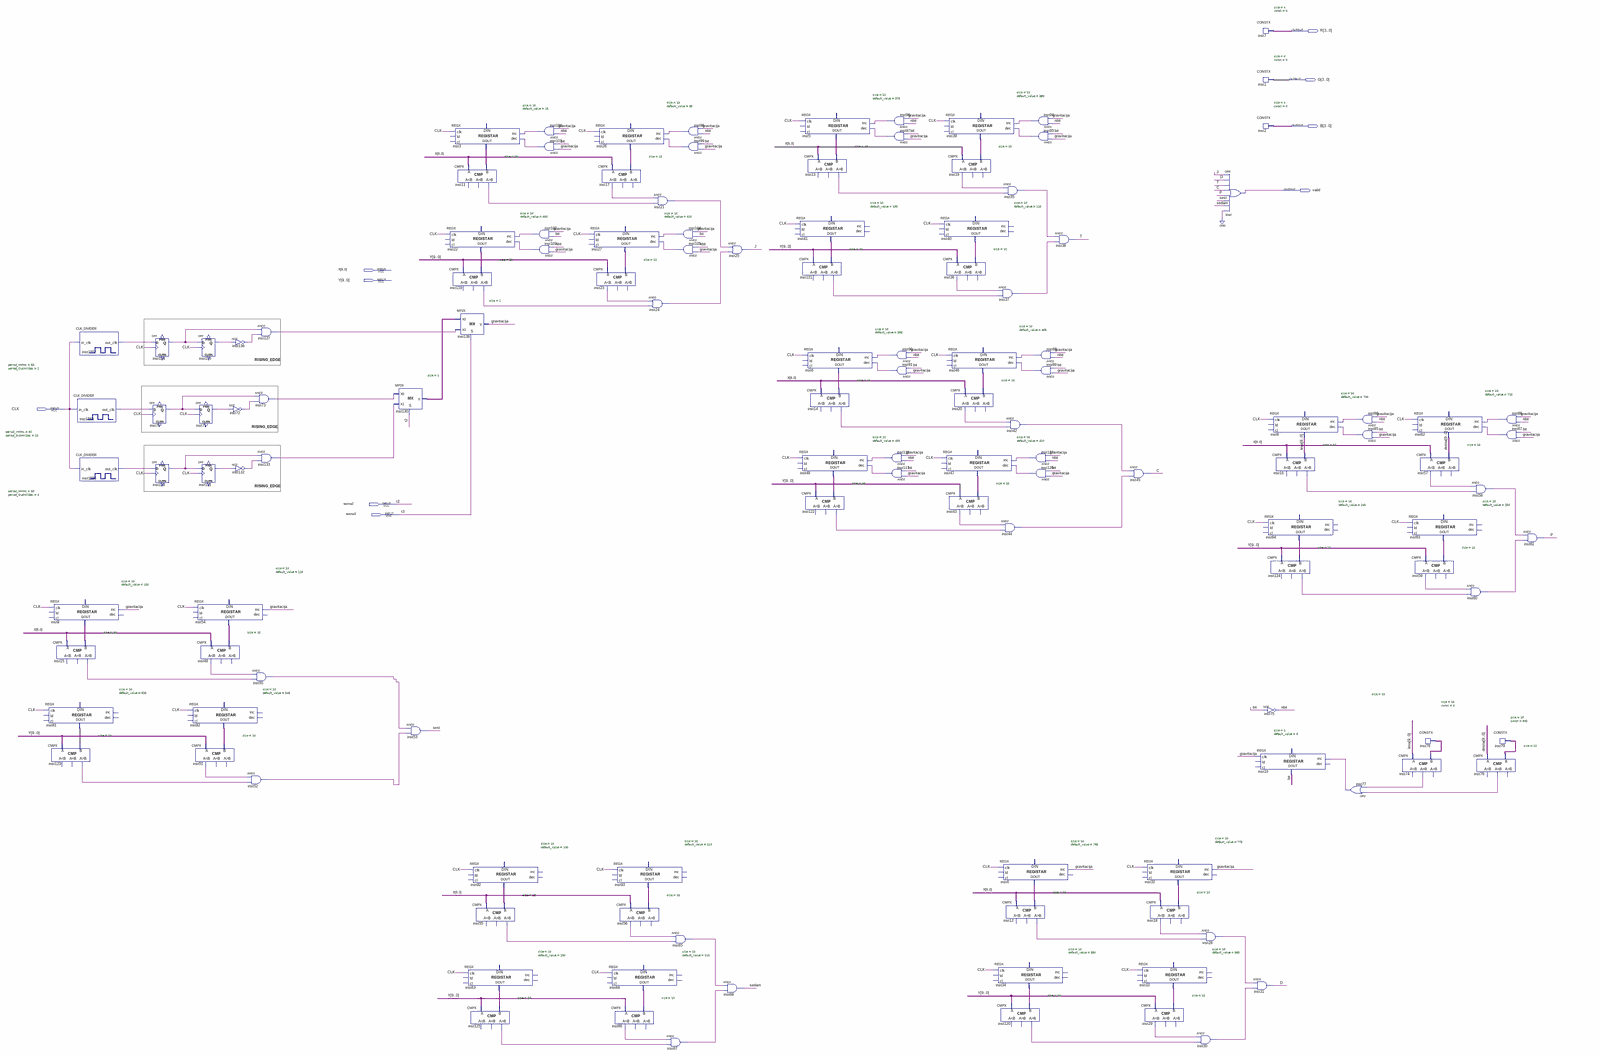
[diagram p0: schematic sheet, whole]
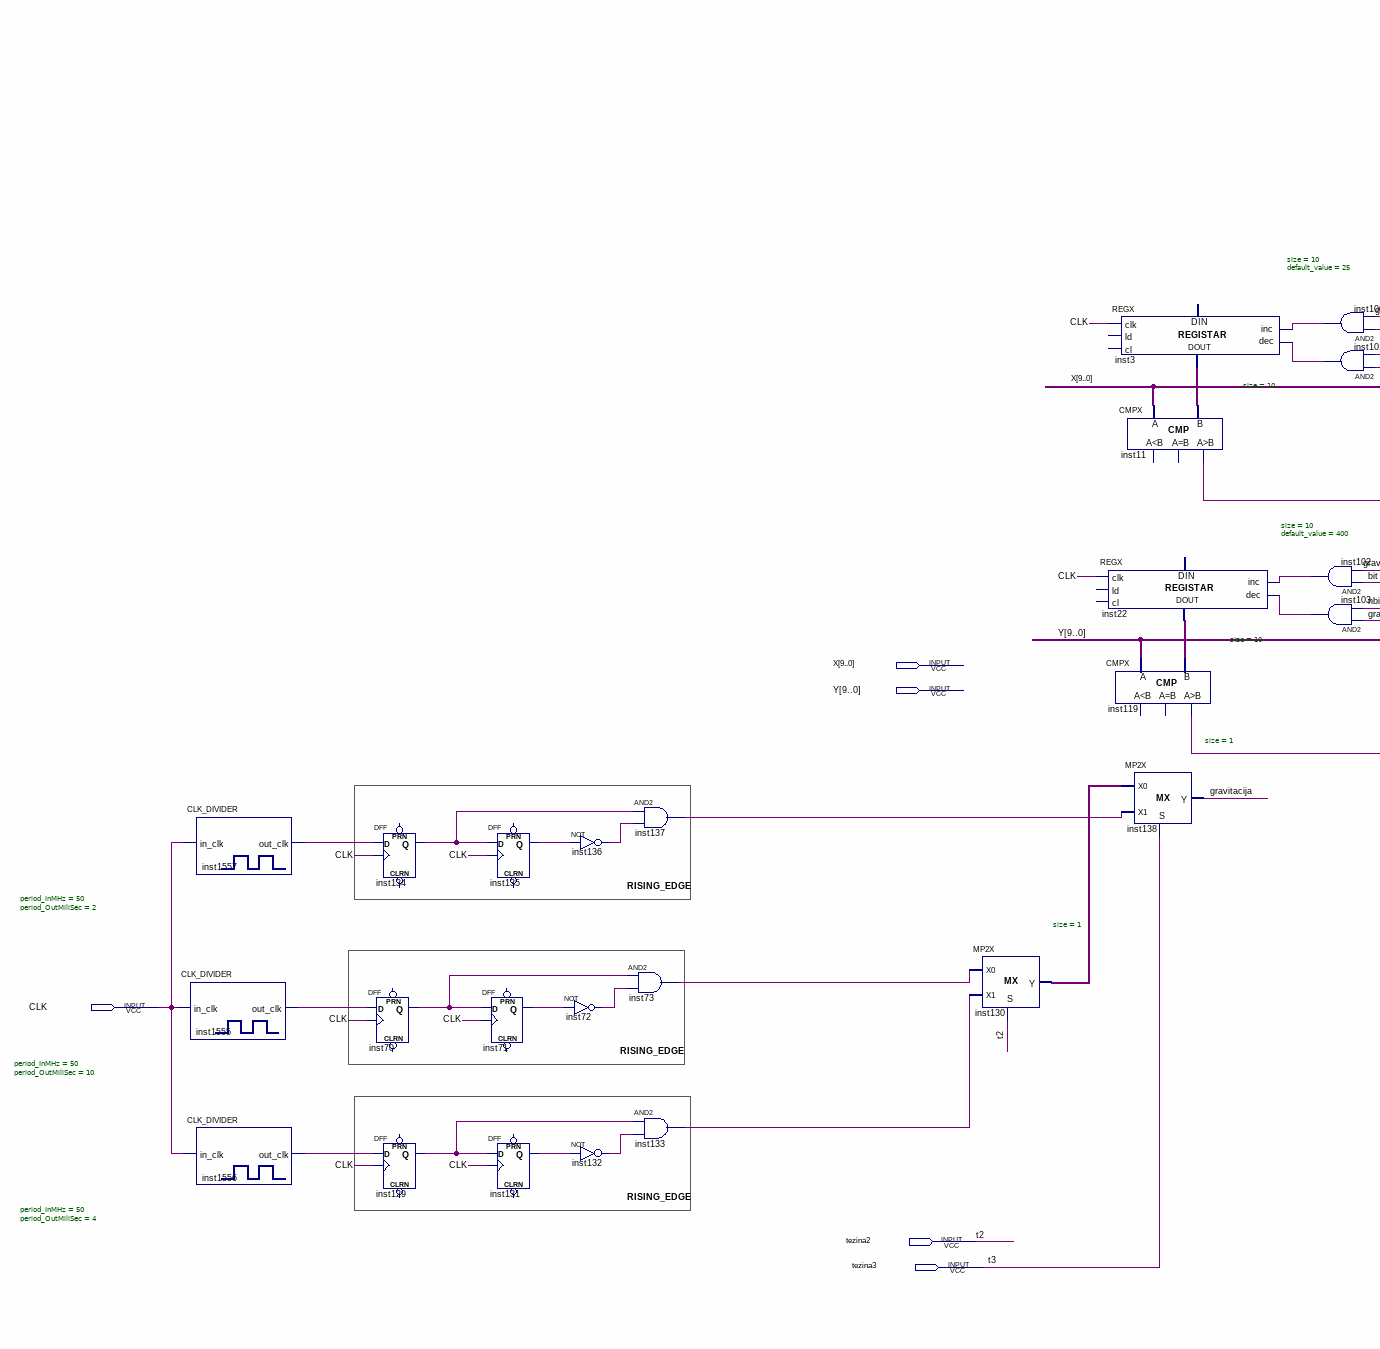
[diagram p1: schematic sheet, upper left part]
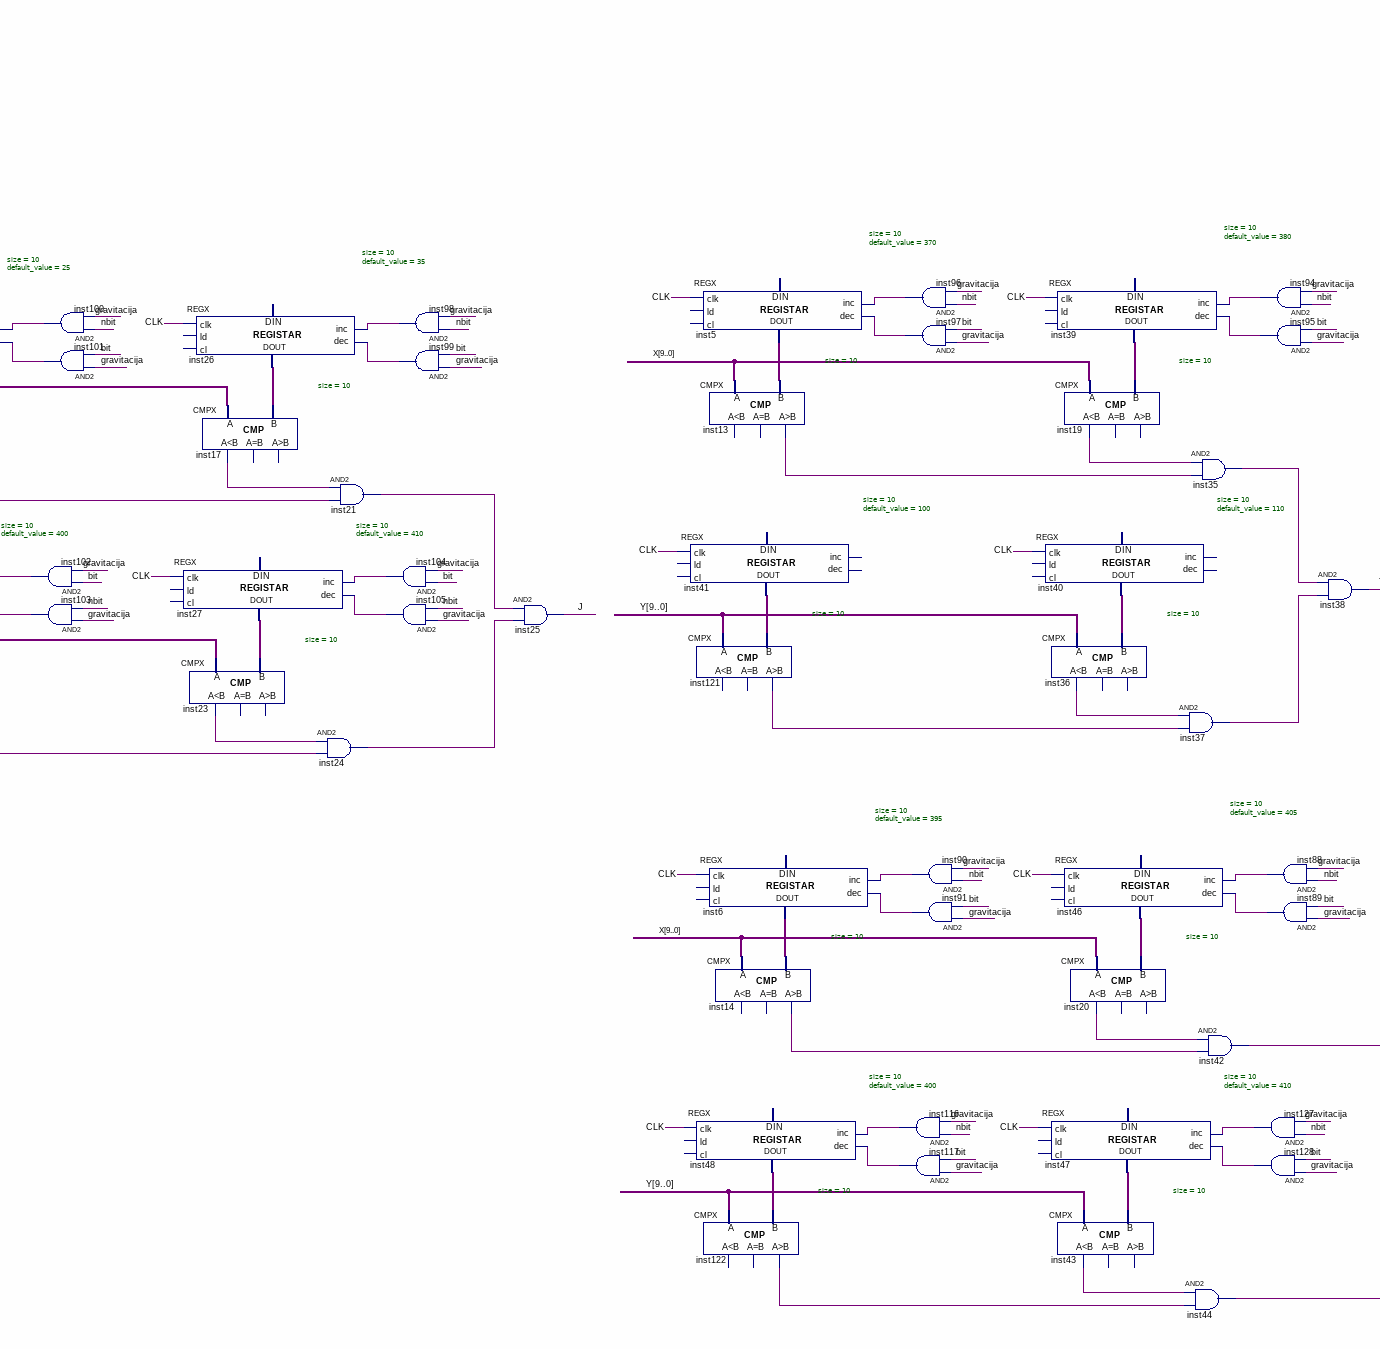
[diagram p2: schematic sheet, upper centre part]
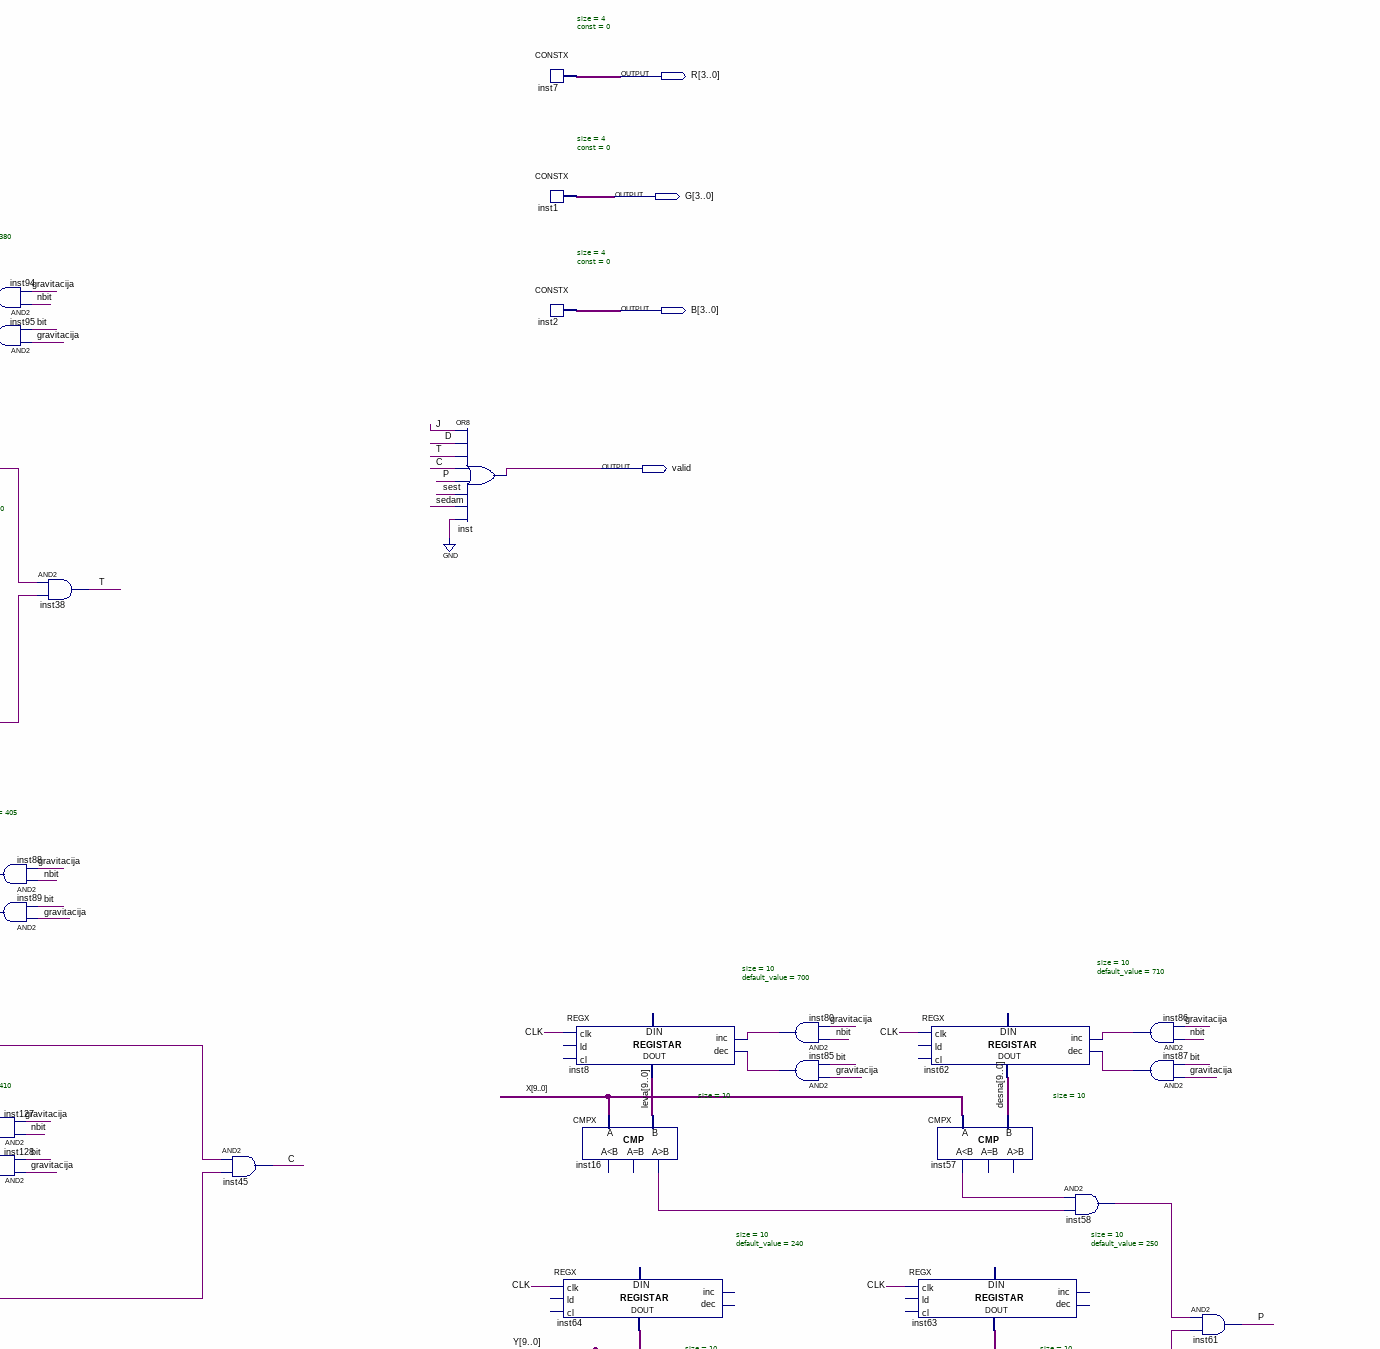
[diagram p3: schematic sheet, upper right part]
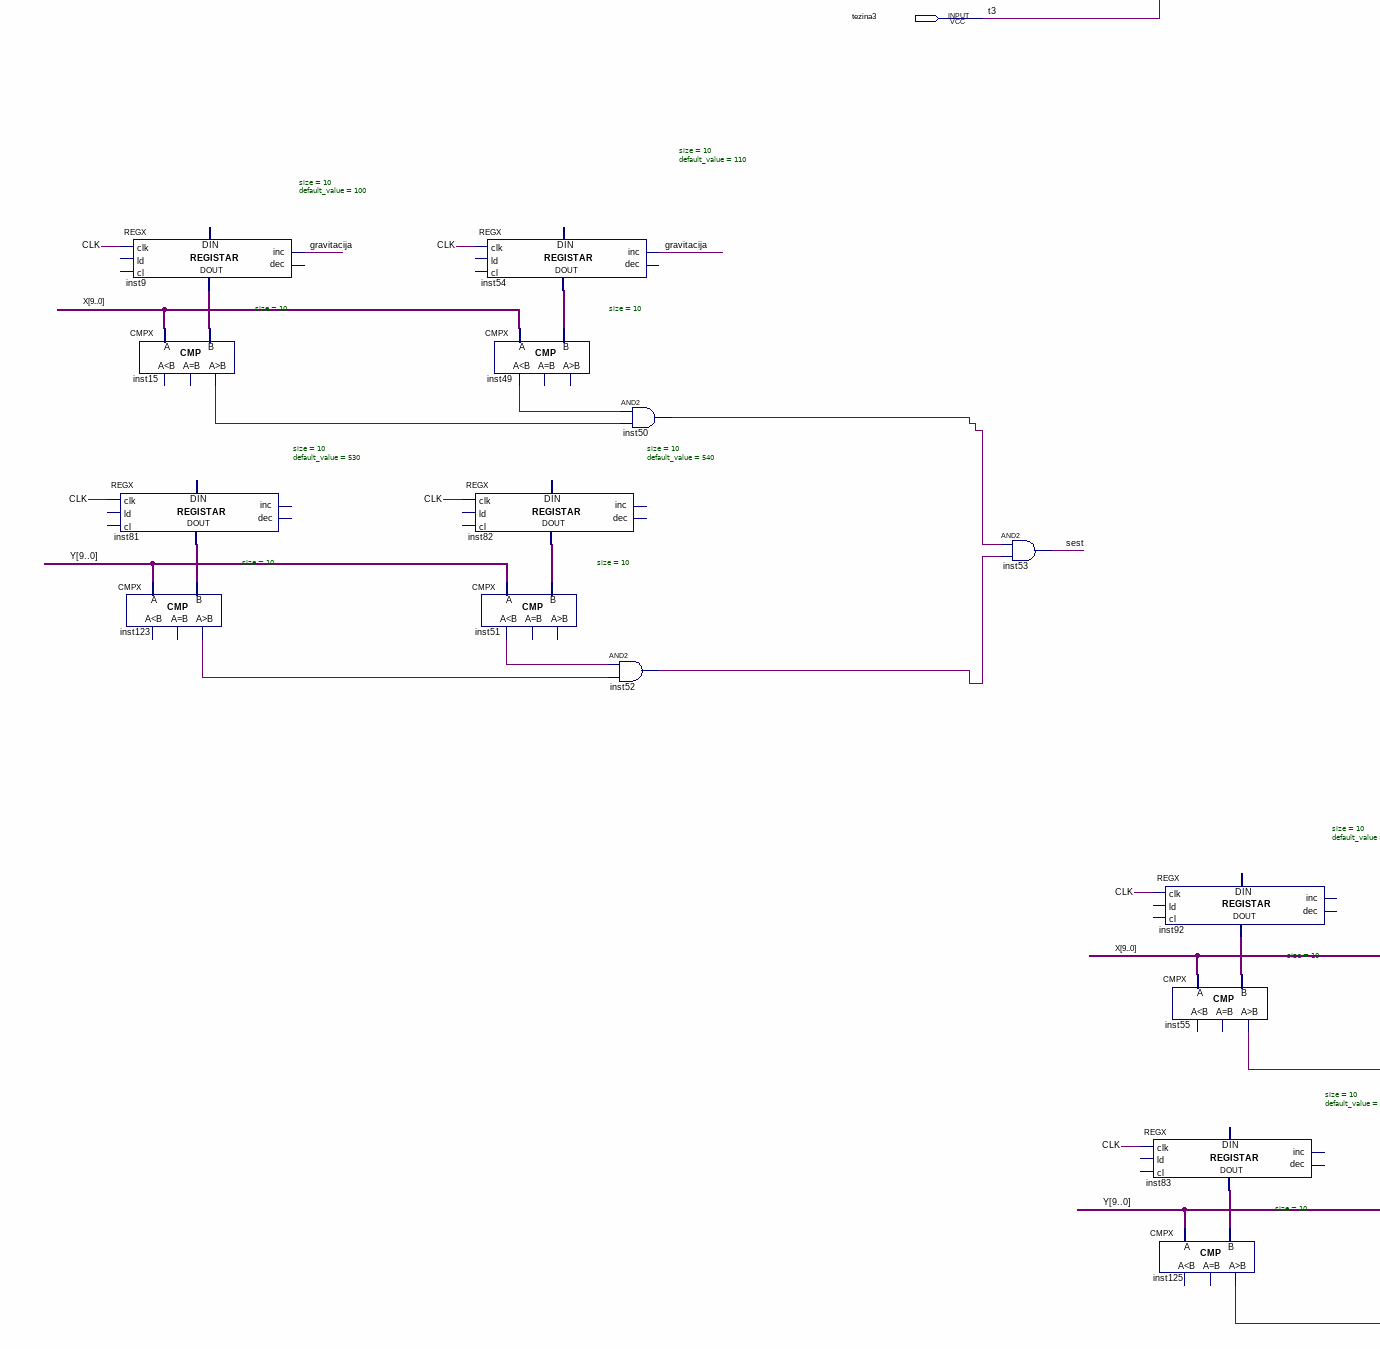
[diagram p4: schematic sheet, lower left part]
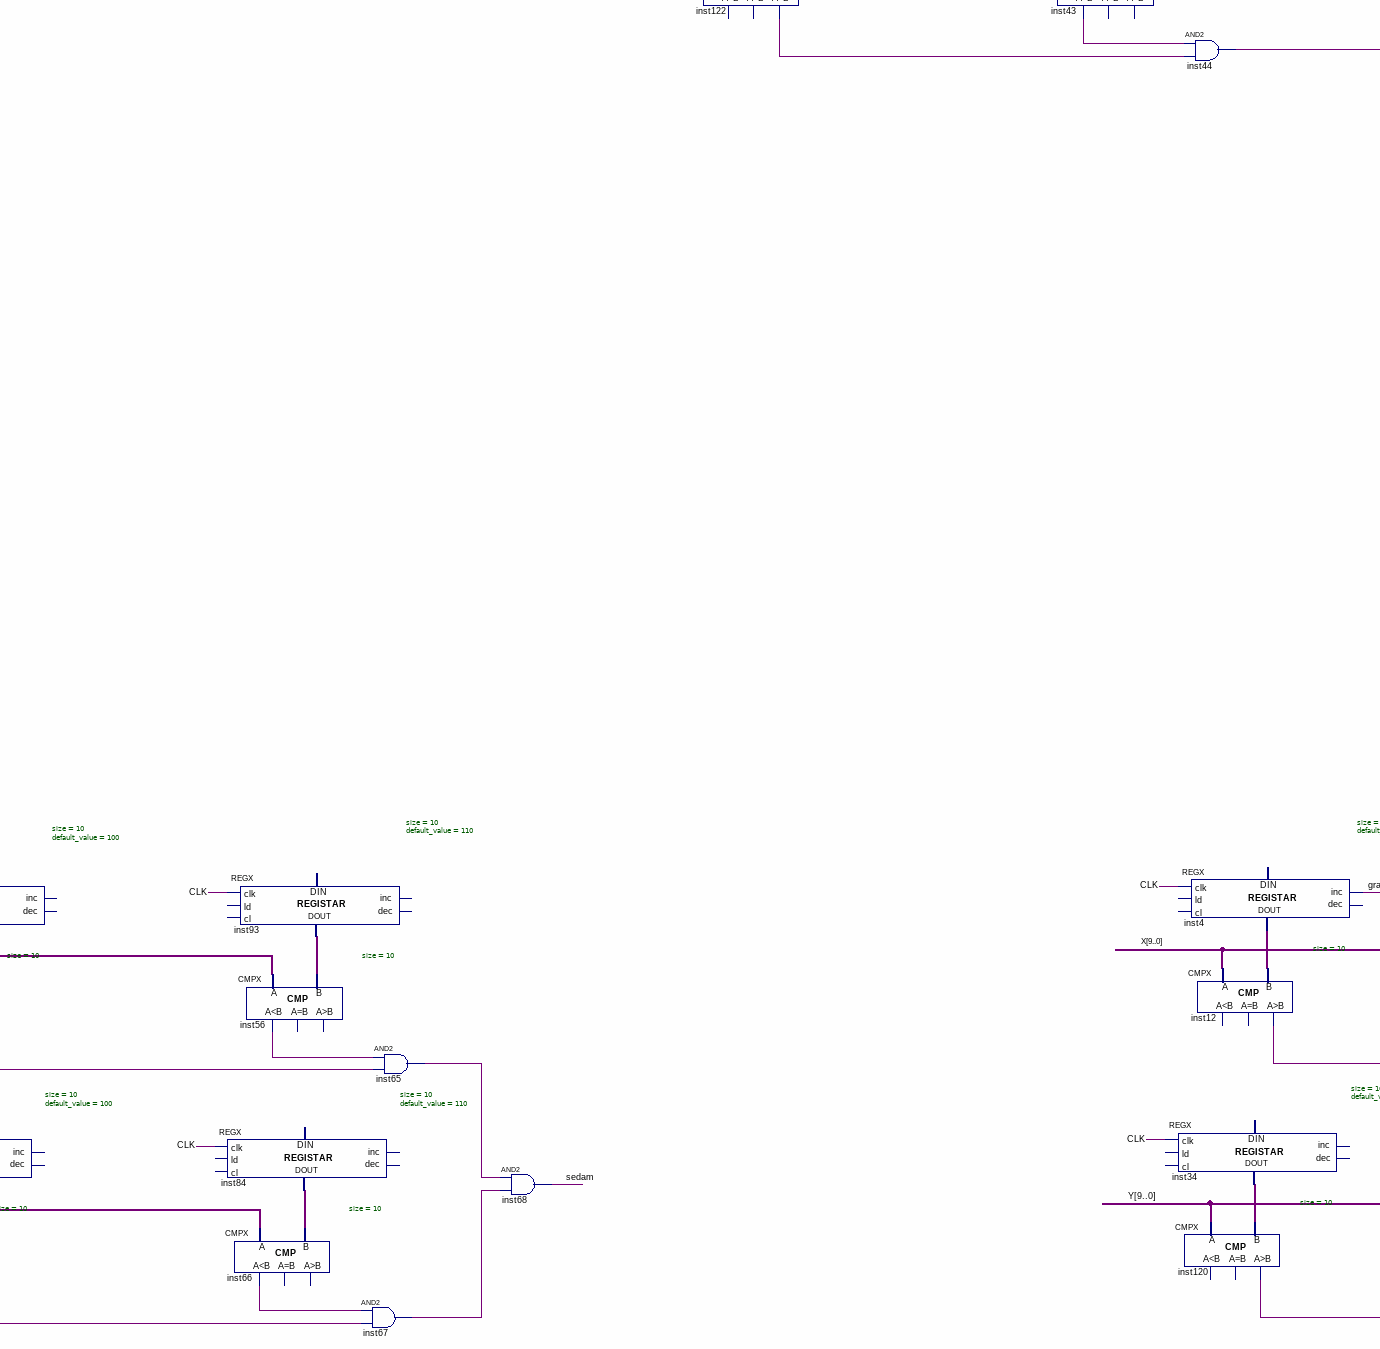
[diagram p5: schematic sheet, lower centre part]
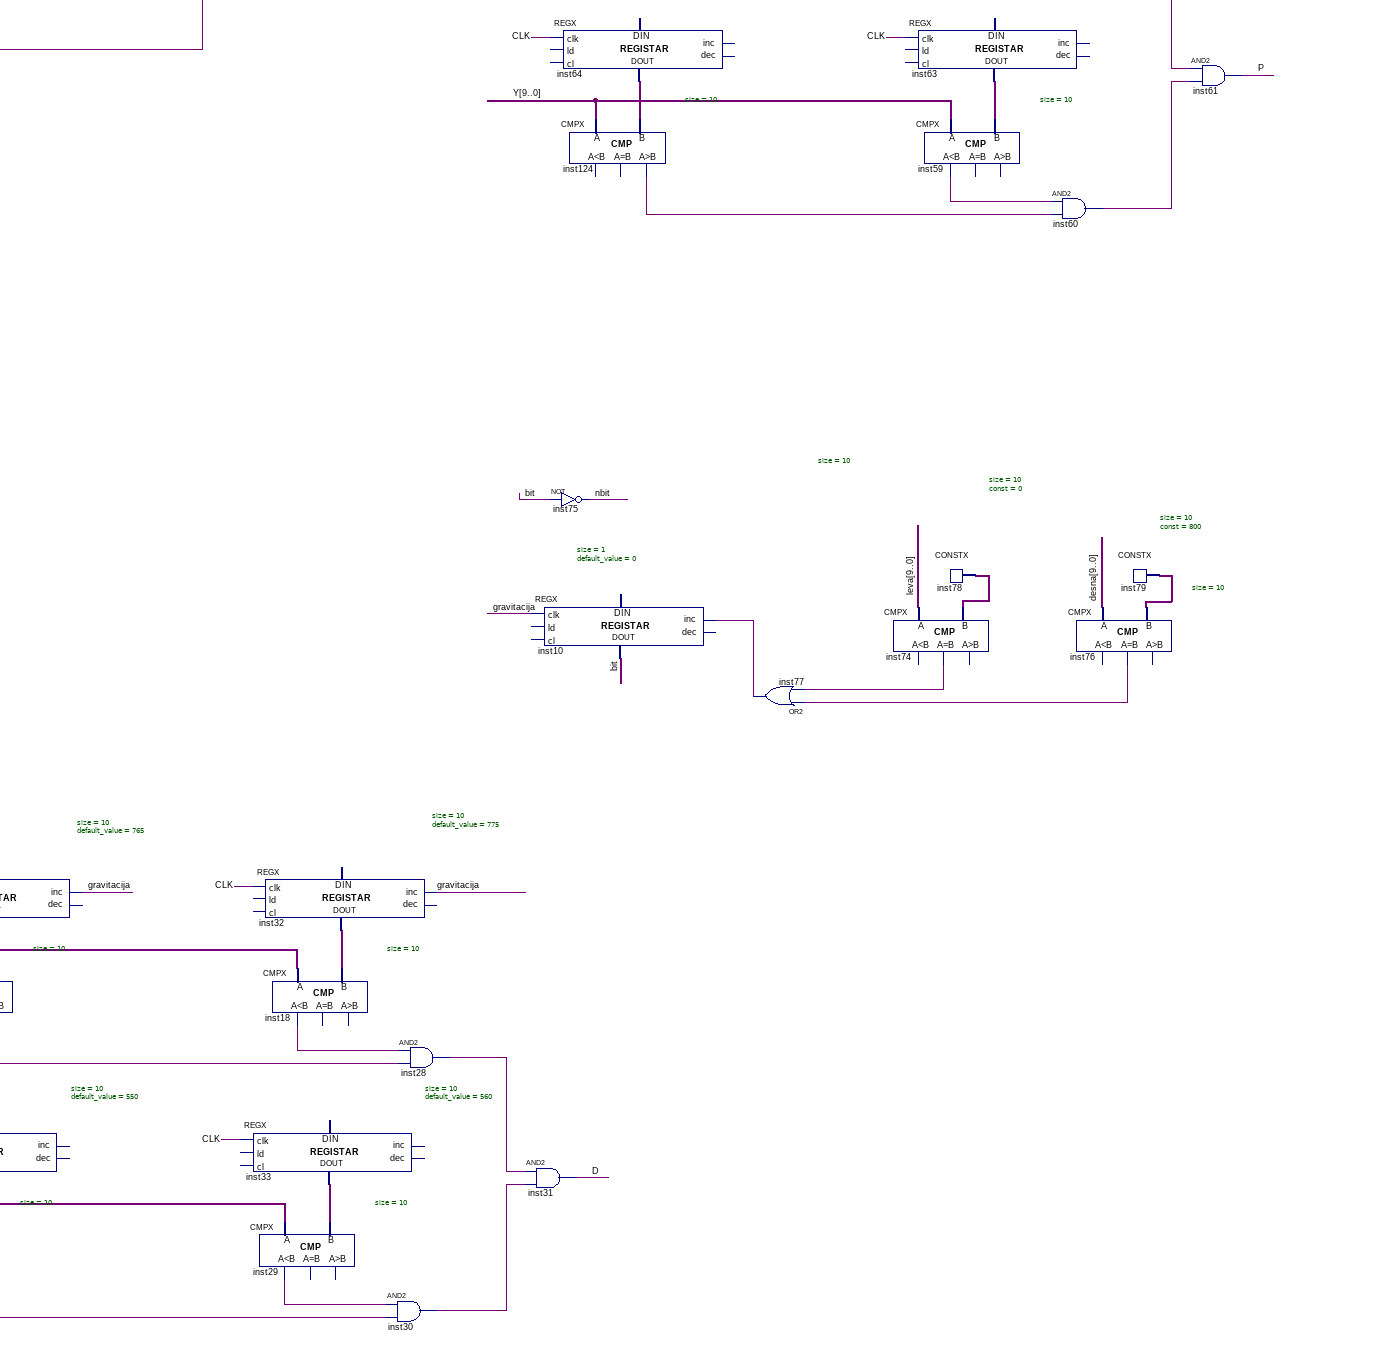
[diagram p6: schematic sheet, lower right part]
// Quartus schematic Block1.bdf as structural Verilog: 129 symbols, 9 pins
module Block1 (
  input  [9:0] X,
  input  [9:0] Y,
  input  CLK,
  input  tezina2,
  input  tezina3,
  output [3:0] R,
  output [3:0] G,
  output [3:0] B,
  output valid
);

  wire \bit , C, D, gravitacija, inst11_gr, inst12_gr, inst13_gr, inst14_gr, inst15_gr, inst16_gr, inst17_ls,
       inst18_ls, inst19_ls, inst20_ls, inst21_out, inst23_ls, inst24_out, inst28_out, inst29_ls, inst30_out,
       inst35_out, inst36_ls, inst37_out, inst42_out, inst43_ls, inst44_out, inst49_ls, inst50_out,
       inst51_ls, inst52_out, inst55_gr, inst56_ls, inst57_ls, inst58_out, inst59_ls, inst60_out, inst65_out,
       inst66_ls, inst67_out, inst70_q, inst71_q, inst72_out, inst73_out, inst74_eq, inst76_eq, inst77_out,
       inst80_out, inst85_out, inst86_out, inst87_out, inst88_out, inst89_out, inst90_out, inst91_out,
       inst94_out, inst95_out, inst96_out, inst97_out, inst98_out, inst99_out, inst100_out, inst101_out,
       inst102_out, inst103_out, inst104_out, inst105_out, inst116_out, inst117_out, inst119_gr, inst120_gr,
       inst121_gr, inst122_gr, inst123_gr, inst124_gr, inst125_gr, inst127_out, inst128_out, inst129_q,
       inst130_y, inst131_q, inst132_out, inst133_out, inst134_q, inst135_q, inst136_out, inst137_out,
       inst1555_out_clk, inst1556_out_clk, inst1557_out_clk, J, nbit, P, sedam, sest, T;
  wire [9:0] desna, inst3_data_out, inst4_data_out, inst5_data_out, inst6_data_out, inst9_data_out,
       inst22_data_out, inst26_data_out, inst27_data_out, inst32_data_out, inst33_data_out, inst34_data_out,
       inst39_data_out, inst40_data_out, inst41_data_out, inst46_data_out, inst47_data_out, inst48_data_out,
       inst54_data_out, inst63_data_out, inst64_data_out, inst78_data, inst79_data, inst81_data_out,
       inst82_data_out, inst83_data_out, inst84_data_out, inst92_data_out, inst93_data_out, leva;

  REGX #(.size(10), .default_value(100)) inst9 (
    .clk(CLK), .inc(gravitacija), .data_out(inst9_data_out));  // open: ld, cl, dec, data_in
  CMPX #(.size(10)) inst15 (.A(X), .B(inst9_data_out), .gr(inst15_gr));  // open: ls, eq
  REGX #(.size(10), .default_value(530)) inst81 (
    .clk(CLK), .data_out(inst81_data_out));  // open: ld, cl, inc, dec, data_in
  CMPX #(.size(10)) inst123 (.A(Y), .B(inst81_data_out), .gr(inst123_gr));  // open: ls, eq
  CLK_DIVIDER #(.period_InMHz(50), .period_OutMiliSec(10)) inst1555 (.in_clk(CLK), .out_clk(inst1555_out_clk));
  CLK_DIVIDER #(.period_InMHz(50), .period_OutMiliSec(2)) inst1557 (.in_clk(CLK), .out_clk(inst1557_out_clk));
  CLK_DIVIDER #(.period_InMHz(50), .period_OutMiliSec(4)) inst1556 (.in_clk(CLK), .out_clk(inst1556_out_clk));
  DFF inst134 (.CLK(CLK), .D(inst1557_out_clk), .Q(inst134_q));  // open: CLRN, PRN
  DFF inst70 (.CLK(CLK), .D(inst1555_out_clk), .Q(inst70_q));  // open: CLRN, PRN
  DFF inst129 (.CLK(CLK), .D(inst1556_out_clk), .Q(inst129_q));  // open: CLRN, PRN
  DFF inst71 (.CLK(CLK), .D(inst70_q), .Q(inst71_q));  // open: CLRN, PRN
  REGX #(.size(10), .default_value(110)) inst54 (
    .clk(CLK), .inc(gravitacija), .data_out(inst54_data_out));  // open: ld, cl, dec, data_in
  CMPX #(.size(10)) inst49 (.A(X), .B(inst54_data_out), .ls(inst49_ls));  // open: eq, gr
  REGX #(.size(10), .default_value(540)) inst82 (
    .clk(CLK), .data_out(inst82_data_out));  // open: ld, cl, inc, dec, data_in
  CMPX #(.size(10)) inst51 (.A(Y), .B(inst82_data_out), .ls(inst51_ls));  // open: eq, gr
  DFF inst135 (.CLK(CLK), .D(inst134_q), .Q(inst135_q));  // open: CLRN, PRN
  DFF inst131 (.CLK(CLK), .D(inst129_q), .Q(inst131_q));  // open: CLRN, PRN
  not inst136 (inst136_out, inst135_q);
  not inst72 (inst72_out, inst71_q);
  not inst132 (inst132_out, inst131_q);
  and inst137 (inst137_out, inst134_q, inst136_out);
  and inst73 (inst73_out, inst70_q, inst72_out);
  and inst133 (inst133_out, inst129_q, inst132_out);
  and inst50 (inst50_out, inst49_ls, inst15_gr);
  and inst52 (inst52_out, inst51_ls, inst123_gr);
  MP2X #(.size(1)) inst130 (.S(tezina2), .X0(inst73_out), .X1(inst133_out), .Y(inst130_y));
  and inst53 (sest, inst50_out, inst52_out);
  REGX #(.size(10), .default_value(25)) inst3 (
    .clk(CLK), .inc(inst100_out), .dec(inst101_out), .data_out(inst3_data_out));  // open: ld, cl, data_in
  CMPX #(.size(10)) inst11 (.A(X), .B(inst3_data_out), .gr(inst11_gr));  // open: ls, eq
  REGX #(.size(10), .default_value(400)) inst22 (
    .clk(CLK), .inc(inst102_out), .dec(inst103_out), .data_out(inst22_data_out));  // open: ld, cl, data_in
  CMPX #(.size(10)) inst119 (.A(Y), .B(inst22_data_out), .gr(inst119_gr));  // open: ls, eq
  MP2X #(.size(1)) inst138 (.S(tezina3), .X0(inst130_y), .X1(inst137_out), .Y(gravitacija));
  REGX #(.size(10), .default_value(100)) inst83 (
    .clk(CLK), .data_out(inst83_data_out));  // open: ld, cl, inc, dec, data_in
  REGX #(.size(10), .default_value(100)) inst92 (
    .clk(CLK), .data_out(inst92_data_out));  // open: ld, cl, inc, dec, data_in
  CMPX #(.size(10)) inst55 (.A(X), .B(inst92_data_out), .gr(inst55_gr));  // open: ls, eq
  CMPX #(.size(10)) inst125 (.A(Y), .B(inst83_data_out), .gr(inst125_gr));  // open: ls, eq
  and inst100 (inst100_out, nbit, gravitacija);
  and inst101 (inst101_out, gravitacija, \bit );
  and inst102 (inst102_out, \bit , gravitacija);
  and inst103 (inst103_out, gravitacija, nbit);
  REGX #(.size(10), .default_value(35)) inst26 (
    .clk(CLK), .inc(inst98_out), .dec(inst99_out), .data_out(inst26_data_out));  // open: ld, cl, data_in
  CMPX #(.size(10)) inst17 (.A(X), .B(inst26_data_out), .ls(inst17_ls));  // open: eq, gr
  REGX #(.size(10), .default_value(410)) inst27 (
    .clk(CLK), .inc(inst104_out), .dec(inst105_out), .data_out(inst27_data_out));  // open: ld, cl, data_in
  CMPX #(.size(10)) inst23 (.A(Y), .B(inst27_data_out), .ls(inst23_ls));  // open: eq, gr
  REGX #(.size(10), .default_value(110)) inst84 (
    .clk(CLK), .data_out(inst84_data_out));  // open: ld, cl, inc, dec, data_in
  REGX #(.size(10), .default_value(110)) inst93 (
    .clk(CLK), .data_out(inst93_data_out));  // open: ld, cl, inc, dec, data_in
  CMPX #(.size(10)) inst56 (.A(X), .B(inst93_data_out), .ls(inst56_ls));  // open: eq, gr
  CMPX #(.size(10)) inst66 (.A(Y), .B(inst84_data_out), .ls(inst66_ls));  // open: eq, gr
  and inst24 (inst24_out, inst23_ls, inst119_gr);
  and inst21 (inst21_out, inst17_ls, inst11_gr);
  and inst67 (inst67_out, inst66_ls, inst125_gr);
  and inst98 (inst98_out, nbit, gravitacija);
  and inst99 (inst99_out, gravitacija, \bit );
  and inst104 (inst104_out, \bit , gravitacija);
  and inst105 (inst105_out, gravitacija, nbit);
  and inst65 (inst65_out, inst56_ls, inst55_gr);
  and inst25 (J, inst21_out, inst24_out);
  and inst68 (sedam, inst65_out, inst67_out);
  REGX #(.size(10), .default_value(370)) inst5 (
    .clk(CLK), .inc(inst96_out), .dec(inst97_out), .data_out(inst5_data_out));  // open: ld, cl, data_in
  CMPX #(.size(10)) inst13 (.A(X), .B(inst5_data_out), .gr(inst13_gr));  // open: ls, eq
  REGX #(.size(10), .default_value(100)) inst41 (
    .clk(CLK), .data_out(inst41_data_out));  // open: ld, cl, inc, dec, data_in
  CMPX #(.size(10)) inst121 (.A(Y), .B(inst41_data_out), .gr(inst121_gr));  // open: ls, eq
  REGX #(.size(10), .default_value(395)) inst6 (
    .clk(CLK), .inc(inst90_out), .dec(inst91_out), .data_out(inst6_data_out));  // open: ld, cl, data_in
  CMPX #(.size(10)) inst14 (.A(X), .B(inst6_data_out), .gr(inst14_gr));  // open: ls, eq
  REGX #(.size(10), .default_value(400)) inst48 (
    .clk(CLK), .inc(inst116_out), .dec(inst117_out), .data_out(inst48_data_out));  // open: ld, cl, data_in
  CMPX #(.size(10)) inst122 (.A(Y), .B(inst48_data_out), .gr(inst122_gr));  // open: ls, eq
  and inst96 (inst96_out, nbit, gravitacija);
  and inst97 (inst97_out, gravitacija, \bit );
  and inst90 (inst90_out, nbit, gravitacija);
  and inst91 (inst91_out, gravitacija, \bit );
  and inst116 (inst116_out, nbit, gravitacija);
  and inst117 (inst117_out, gravitacija, \bit );
  REGX #(.size(10), .default_value(380)) inst39 (
    .clk(CLK), .inc(inst94_out), .dec(inst95_out), .data_out(inst39_data_out));  // open: ld, cl, data_in
  CMPX #(.size(10)) inst19 (.A(X), .B(inst39_data_out), .ls(inst19_ls));  // open: eq, gr
  REGX #(.size(10), .default_value(110)) inst40 (
    .clk(CLK), .data_out(inst40_data_out));  // open: ld, cl, inc, dec, data_in
  CMPX #(.size(10)) inst36 (.A(Y), .B(inst40_data_out), .ls(inst36_ls));  // open: eq, gr
  REGX #(.size(10), .default_value(405)) inst46 (
    .clk(CLK), .inc(inst88_out), .dec(inst89_out), .data_out(inst46_data_out));  // open: ld, cl, data_in
  CMPX #(.size(10)) inst20 (.A(X), .B(inst46_data_out), .ls(inst20_ls));  // open: eq, gr
  REGX #(.size(10), .default_value(410)) inst47 (
    .clk(CLK), .inc(inst127_out), .dec(inst128_out), .data_out(inst47_data_out));  // open: ld, cl, data_in
  CMPX #(.size(10)) inst43 (.A(Y), .B(inst47_data_out), .ls(inst43_ls));  // open: eq, gr
  and inst37 (inst37_out, inst36_ls, inst121_gr);
  REGX #(.size(10), .default_value(765)) inst4 (
    .clk(CLK), .inc(gravitacija), .data_out(inst4_data_out));  // open: ld, cl, dec, data_in
  REGX #(.size(10), .default_value(550)) inst34 (
    .clk(CLK), .data_out(inst34_data_out));  // open: ld, cl, inc, dec, data_in
  CMPX #(.size(10)) inst120 (.A(Y), .B(inst34_data_out), .gr(inst120_gr));  // open: ls, eq
  and inst35 (inst35_out, inst19_ls, inst13_gr);
  and inst42 (inst42_out, inst20_ls, inst14_gr);
  and inst44 (inst44_out, inst43_ls, inst122_gr);
  CMPX #(.size(10)) inst12 (.A(X), .B(inst4_data_out), .gr(inst12_gr));  // open: ls, eq
  and inst94 (inst94_out, nbit, gravitacija);
  and inst95 (inst95_out, gravitacija, \bit );
  and inst88 (inst88_out, nbit, gravitacija);
  and inst89 (inst89_out, gravitacija, \bit );
  and inst127 (inst127_out, nbit, gravitacija);
  and inst128 (inst128_out, gravitacija, \bit );
  and inst38 (T, inst35_out, inst37_out);
  and inst45 (C, inst42_out, inst44_out);
  REGX #(.size(10), .default_value(775)) inst32 (
    .clk(CLK), .inc(gravitacija), .data_out(inst32_data_out));  // open: ld, cl, dec, data_in
  REGX #(.size(10), .default_value(560)) inst33 (
    .clk(CLK), .data_out(inst33_data_out));  // open: ld, cl, inc, dec, data_in
  CMPX #(.size(10)) inst29 (.A(Y), .B(inst33_data_out), .ls(inst29_ls));  // open: eq, gr
  CMPX #(.size(10)) inst18 (.A(X), .B(inst32_data_out), .ls(inst18_ls));  // open: eq, gr
  and inst28 (inst28_out, inst18_ls, inst12_gr);
  and inst30 (inst30_out, inst29_ls, inst120_gr);
  or inst (valid, J, D, T, C, P, sest, sedam, 1'b0);
  CONSTX #(.size(4), .\const (0)) inst7 (.data(R));
  CONSTX #(.size(4), .\const (0)) inst1 (.data(G));
  CONSTX #(.size(4), .\const (0)) inst2 (.data(B));
  REGX #(.size(10), .default_value(240)) inst64 (
    .clk(CLK), .data_out(inst64_data_out));  // open: ld, cl, inc, dec, data_in
  CMPX #(.size(10)) inst124 (.A(Y), .B(inst64_data_out), .gr(inst124_gr));  // open: ls, eq
  not inst75 (nbit, \bit );
  REGX #(.size(1), .default_value(0)) inst10 (
    .clk(gravitacija), .inc(inst77_out), .data_out(\bit ));  // open: ld, cl, dec, data_in
  and inst31 (D, inst28_out, inst30_out);
  REGX #(.size(10), .default_value(700)) inst8 (
    .clk(CLK), .inc(inst80_out), .dec(inst85_out), .data_out(leva));  // open: ld, cl, data_in
  CMPX #(.size(10)) inst16 (.A(X), .B(leva), .gr(inst16_gr));  // open: ls, eq
  or inst77 (inst77_out, inst76_eq, inst74_eq);
  and inst80 (inst80_out, nbit, gravitacija);
  and inst85 (inst85_out, gravitacija, \bit );
  REGX #(.size(10), .default_value(250)) inst63 (
    .clk(CLK), .data_out(inst63_data_out));  // open: ld, cl, inc, dec, data_in
  CMPX #(.size(10)) inst59 (.A(Y), .B(inst63_data_out), .ls(inst59_ls));  // open: eq, gr
  CMPX #(.size(10)) inst74 (.A(leva), .B(inst78_data), .eq(inst74_eq));  // open: ls, gr
  REGX #(.size(10), .default_value(710)) inst62 (
    .clk(CLK), .inc(inst86_out), .dec(inst87_out), .data_out(desna));  // open: ld, cl, data_in
  CMPX #(.size(10)) inst57 (.A(X), .B(desna), .ls(inst57_ls));  // open: eq, gr
  CONSTX #(.size(10), .\const (0)) inst78 (.data(inst78_data));
  and inst58 (inst58_out, inst57_ls, inst16_gr);
  and inst60 (inst60_out, inst59_ls, inst124_gr);
  CMPX #(.size(10)) inst76 (.A(desna), .B(inst79_data), .eq(inst76_eq));  // open: ls, gr
  CONSTX #(.size(10), .\const (800)) inst79 (.data(inst79_data));
  and inst86 (inst86_out, nbit, gravitacija);
  and inst87 (inst87_out, gravitacija, \bit );
  and inst61 (P, inst58_out, inst60_out);

  // Other names for the same wires on the sheet: t2 = tezina2; t3 = tezina3

  // Notes on the sheet:
  //   RISING_EDGE
  //   RISING_EDGE
  //   RISING_EDGE
endmodule
